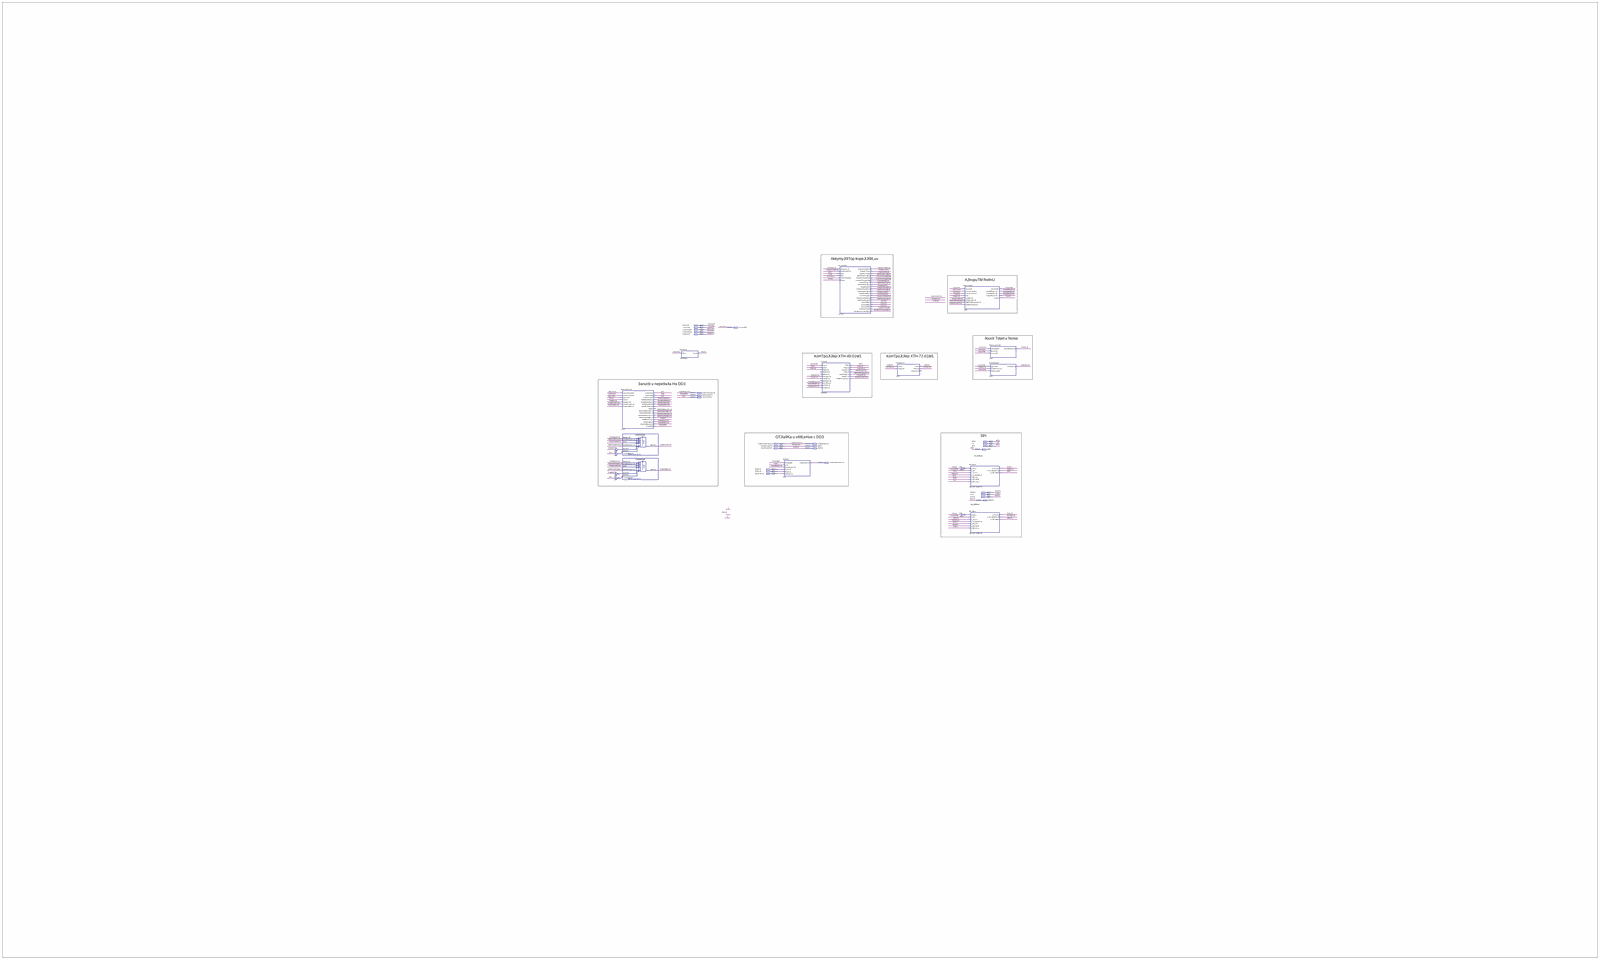
[diagram p0: schematic sheet, whole]
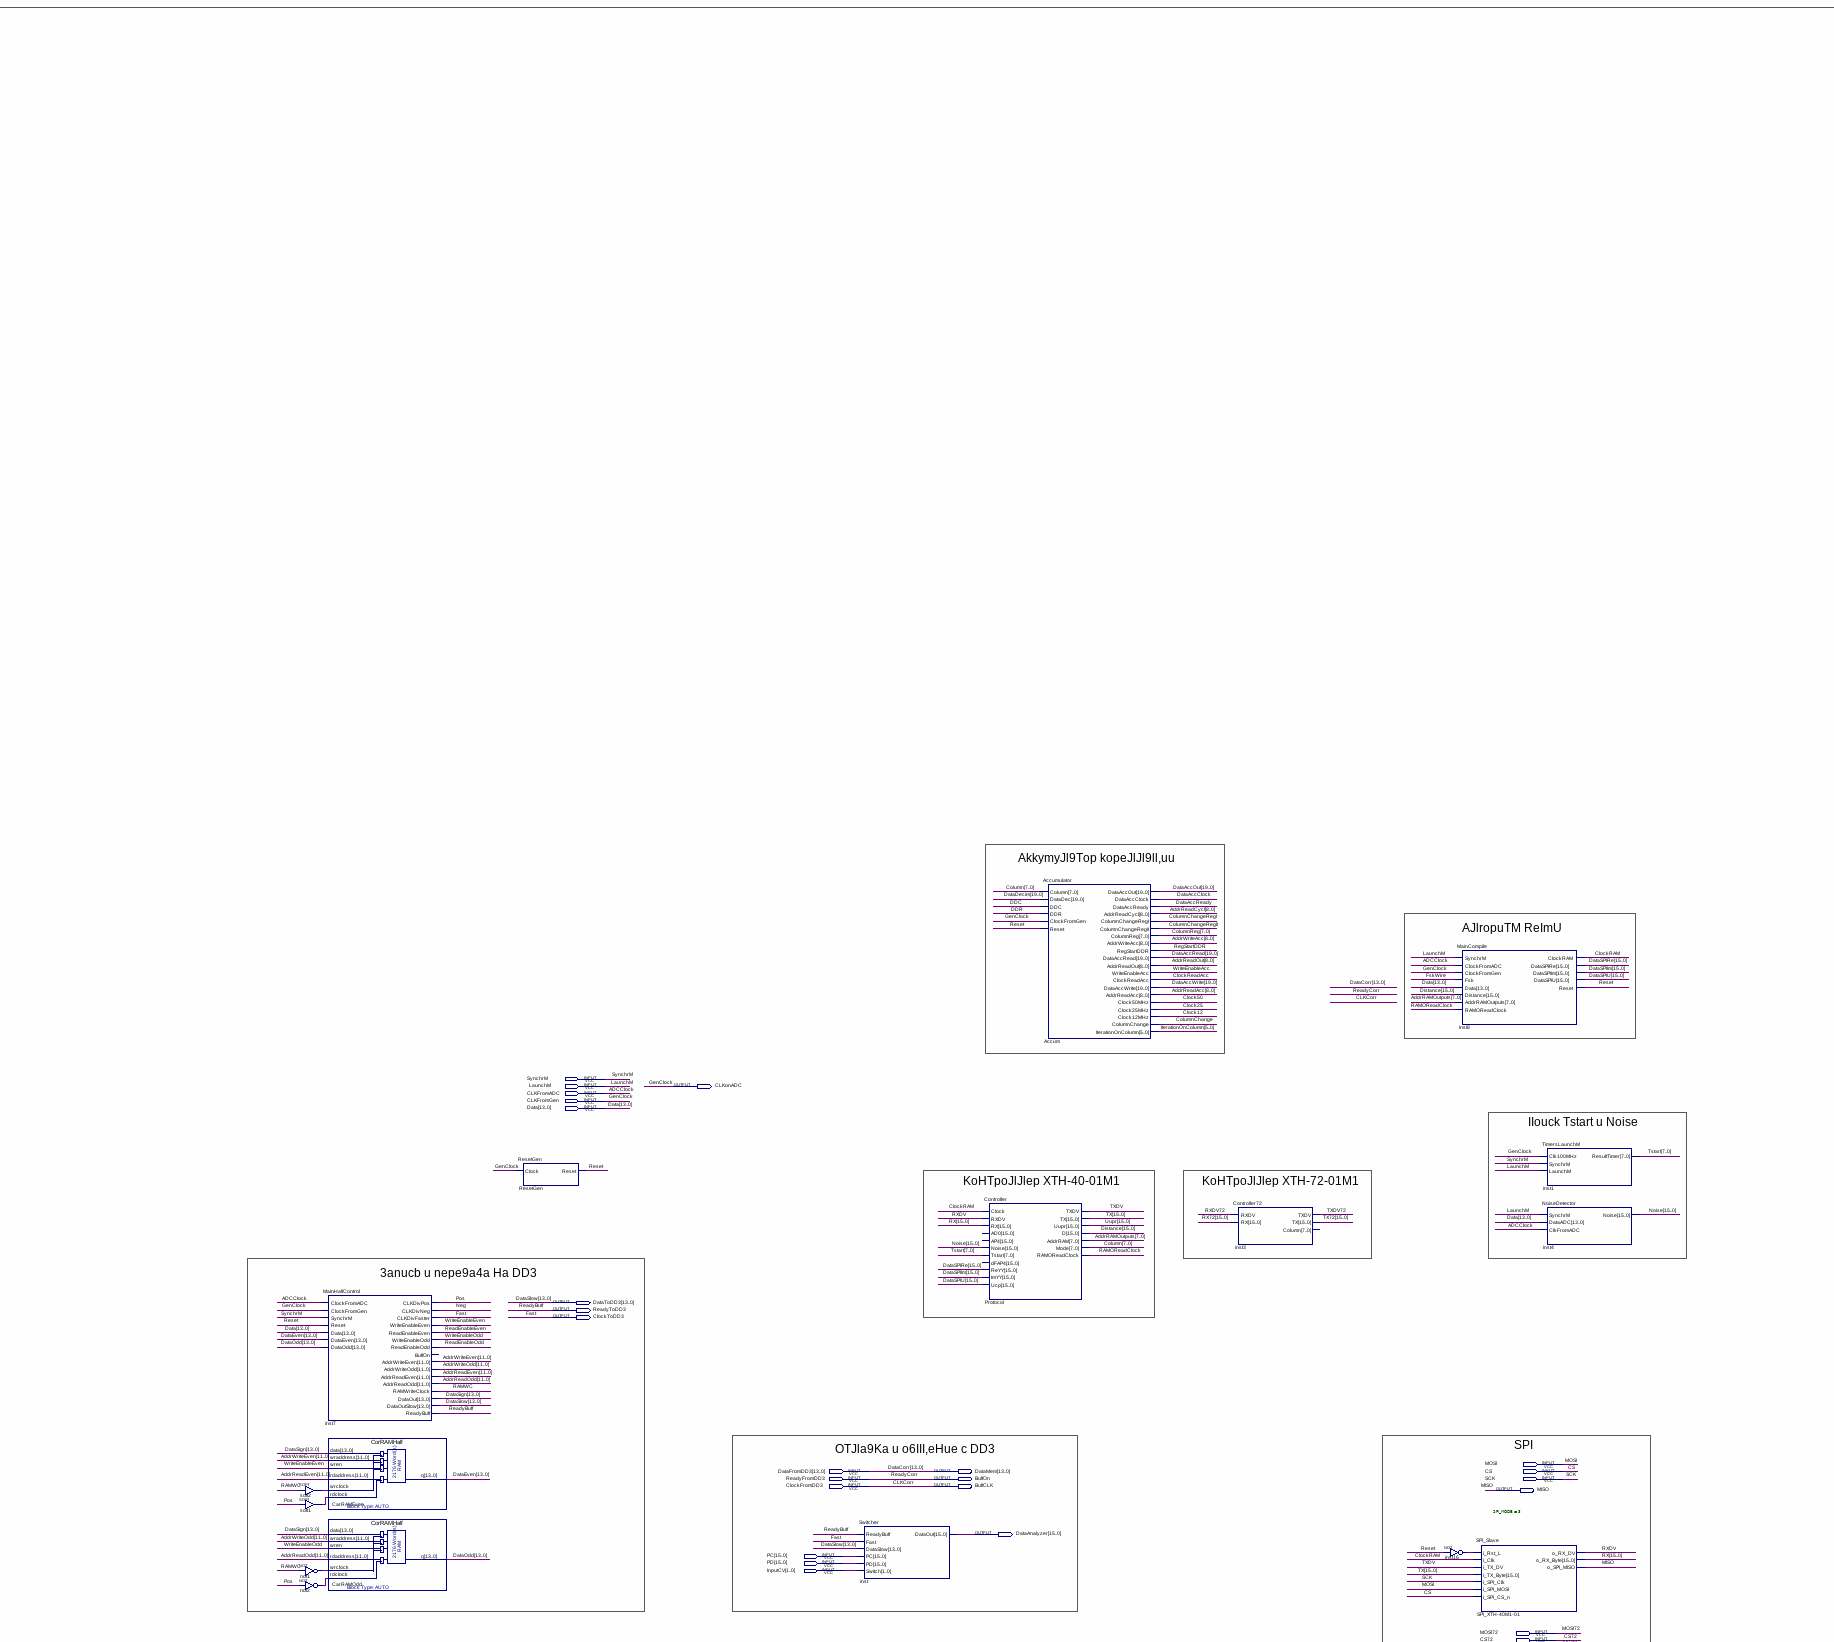
[diagram p1: schematic sheet, upper centre part]
// Quartus schematic MainHalfWithDD3.bdf as structural Verilog: 19 symbols, 27 pins
module MainHalfWithDD3 (
  input  SynchrM,
  input  LaunchM,
  input  CLKFromADC,
  input  CLKFromGen,
  input  [13:0] Data,
  input  MOSI,
  input  [13:0] DataFromDD3,
  input  CS,
  input  ReadyFromDD3,
  input  SCK,
  input  ClockFromDD3,
  input  [15:0] PC,
  input  [15:0] PD,
  input  [1:0] InputCV,
  input  MOSI72,
  input  CS72,
  input  SCK72,
  output CLKonADC,
  output [13:0] DataToDD3,
  output ReadyToDD3,
  output ClockToDD3,
  output [13:0] DataMem,
  output BuffOn,
  output BuffCLK,
  output MISO,
  output [15:0] DataAnalyzer,
  output MISO72
);

  wire Clock12, Clock25, Clock50, ClockRAM, ClockReadAcc, ColumnChange, ColumnChangeRegI, ColumnChangeRegII,
       DataAccClock, DataAccReady, DDC, DDR, FskWire, inst16_out, inst17_out, Neg, not1_out, not2_out, Pos,
       RAMOReadClock, RAMWC, ReadEnableEven, ReadEnableOdd, RegStartDDR, Reset, RXDV, RXDV72, soft1_out,
       soft2_out, TXDV, TXDV72, WriteEnableAcc, WriteEnableEven, WriteEnableOdd;
  wire [5:0] IterationOnColumn;
  wire [7:0] AddrRAMOutputs, Column, ColumnReg, Tstart;
  wire [8:0] AddrReadAcc, AddrReadCycl, AddrReadOut, AddrWriteAcc;
  wire [11:0] AddrReadEven, AddrReadOdd, AddrWriteEven, AddrWriteOdd;
  wire [13:0] DataEven, DataOdd, DataSign;
  wire [15:0] DataSPIIm, DataSPIRe, DataSPIU, Distance, Noise, RX, RX72, TX, TX72, Uupr;
  wire [19:0] DataAccOut, DataAccRead, DataAccWrite, DataDecim;

  SOFT soft2 (.IN(RAMWC), .OUT(soft2_out));
  SOFT soft1 (.IN(Pos), .OUT(soft1_out));
  not not1 (not1_out, RAMWC);
  not not2 (not2_out, Pos);
  MainHalfControl inst7 (
    .ClockFromADC(CLKFromADC), .ClockFromGen(CLKFromGen), .SynchrM(SynchrM), .Reset(Reset), .Data(Data),
    .DataEven(DataEven), .DataOdd(DataOdd), .CLKDivPos(Pos), .CLKDivNeg(Neg), .CLKDivFaster(ClockToDD3),
    .WriteEnableEven(WriteEnableEven), .ReadEnableEven(ReadEnableEven), .WriteEnableOdd(WriteEnableOdd),
    .ReadEnableOdd(ReadEnableOdd), .AddrWriteEven(AddrWriteEven), .AddrWriteOdd(AddrWriteOdd),
    .AddrReadEven(AddrReadEven), .AddrReadOdd(AddrReadOdd), .RAMWriteClock(RAMWC), .DataOut(DataSign),
    .DataOutSlow(DataToDD3), .ReadyBuff(ReadyToDD3));  // open: BuffOn
  CorRAMHalf CarRAMEven (
    .data(DataSign), .wraddress(AddrWriteEven), .wren(WriteEnableEven), .rdaddress(AddrReadEven),
    .wrclock(soft2_out), .rdclock(soft1_out), .q(DataEven));
  CorRAMHalf CarRAMOdd (
    .data(DataSign), .wraddress(AddrWriteOdd), .wren(WriteEnableOdd), .rdaddress(AddrReadOdd),
    .wrclock(not1_out), .rdclock(not2_out), .q(DataOdd));
  ResetGen ResetGen (.Clock(CLKFromGen), .Reset(Reset));
  Switcher inst (
    .ReadyBuff(ReadyToDD3), .Fast(ClockToDD3), .DataSlow(DataToDD3), .PC(PC), .PD(PD), .Switch(InputCV),
    .DataOut(DataAnalyzer));
  Controller Protocol (
    .Clock(ClockRAM), .RXDV(RXDV), .RX(RX), .Noise(Noise), .Tstart(Tstart), .ReYY(DataSPIRe),
    .ImYY(DataSPIIm), .Ucp(DataSPIU), .TXDV(TXDV), .TX(TX), .Uupr(Uupr), .D(Distance),
    .AddrRAM(AddrRAMOutputs), .Mode(Column), .RAMOReadClock(RAMOReadClock));  // open: AD0, AP4, dFAP4
  Accumulator Accum (
    .Column(Column), .DataDec(DataDecim), .DDC(DDC), .DDR(DDR), .ClockFromGen(CLKFromGen), .Reset(Reset),
    .DataAccOut(DataAccOut), .DataAccClock(DataAccClock), .DataAccReady(DataAccReady),
    .AddrReadCycl(AddrReadCycl), .ColumnChangeRegI(ColumnChangeRegI), .ColumnChangeRegII(ColumnChangeRegII),
    .ColumnReg(ColumnReg), .AddrWriteAcc(AddrWriteAcc), .RegStartDDR(RegStartDDR), .DataAccRead(DataAccRead),
    .AddrReadOut(AddrReadOut), .WriteEnableAcc(WriteEnableAcc), .ClockReadAcc(ClockReadAcc),
    .DataAccWrite(DataAccWrite), .AddrReadAcc(AddrReadAcc), .Clock50MHz(Clock50), .Clock25MHz(Clock25),
    .Clock12MHz(Clock12), .ColumnChange(ColumnChange), .IterationOnColumn(IterationOnColumn));
  Controller72 inst3 (.RXDV(RXDV72), .RX(RX72), .TXDV(TXDV72), .TX(TX72));  // open: Column
  MainCompile inst8 (
    .SynchrM(LaunchM), .ClockFromADC(CLKFromADC), .ClockFromGen(CLKFromGen), .Fsk(FskWire), .Data(Data),
    .Distance(Distance), .AddrRAMOutputs(AddrRAMOutputs), .RAMOReadClock(RAMOReadClock), .ClockRAM(ClockRAM),
    .DataSPIRe(DataSPIRe), .DataSPIIm(DataSPIIm), .DataSPIU(DataSPIU), .Reset(Reset));
  not inst16 (inst16_out, Reset);
  not inst17 (inst17_out, Reset);
  SPI_Slave #(.SPI_MODE(3)) \SPI_XTH-40M1-01  (
    .i_Rst_L(inst16_out), .i_Clk(ClockRAM), .i_TX_DV(TXDV), .i_TX_Byte(TX), .i_SPI_Clk(SCK),
    .i_SPI_MOSI(MOSI), .i_SPI_CS_n(CS), .o_RX_DV(RXDV), .o_RX_Byte(RX), .o_SPI_MISO(MISO));
  SPI_Slave #(.SPI_MODE(3)) \SPI_XTH-72M1-01  (
    .i_Rst_L(inst17_out), .i_Clk(ClockRAM), .i_TX_DV(TXDV72), .i_TX_Byte(TX72), .i_SPI_Clk(SCK72),
    .i_SPI_MOSI(MOSI72), .i_SPI_CS_n(CS72), .o_RX_DV(RXDV72), .o_RX_Byte(RX72), .o_SPI_MISO(MISO72));
  TimersLaunchM inst1 (.Clk100MHz(CLKFromGen), .SynchrM(SynchrM), .LaunchM(LaunchM), .ResultTimer(Tstart));
  NoiseDetector inst4 (.SynchrM(LaunchM), .DataADC(Data), .ClkFromADC(CLKFromADC), .Noise(Noise));

  assign BuffCLK = ClockFromDD3;
  assign BuffOn = ReadyFromDD3;
  assign CLKonADC = CLKFromGen;
  assign DataMem = DataFromDD3;

  // Other names for the same wires on the sheet: ADCClock = CLKFromADC; CLKCorr = ClockFromDD3;
  //   DataCorr[13:0] = DataFromDD3; DataSlow[13:0] = DataToDD3; Fast = ClockToDD3; GenClock = CLKFromGen;
  //   ReadyBuff = ReadyToDD3; ReadyCorr = ReadyFromDD3

  // Notes on the sheet:
  //   AkkymyJl9Top kopeJlJl9ll,uu 
  //   AJlropuTM ReImU
  //   IIouck Tstart u Noise
  //   KoHTpoJlJlep XTH-40-01M1
  //   KoHTpoJlJlep XTH-72-01M1
  //   3anucb u nepe9a4a Ha DD3
  //   SPI
  //   OTJla9Ka u o6III,eHue c DD3
endmodule
